# EAGLE design simple-loop3 (EAGLE 6.6.0)
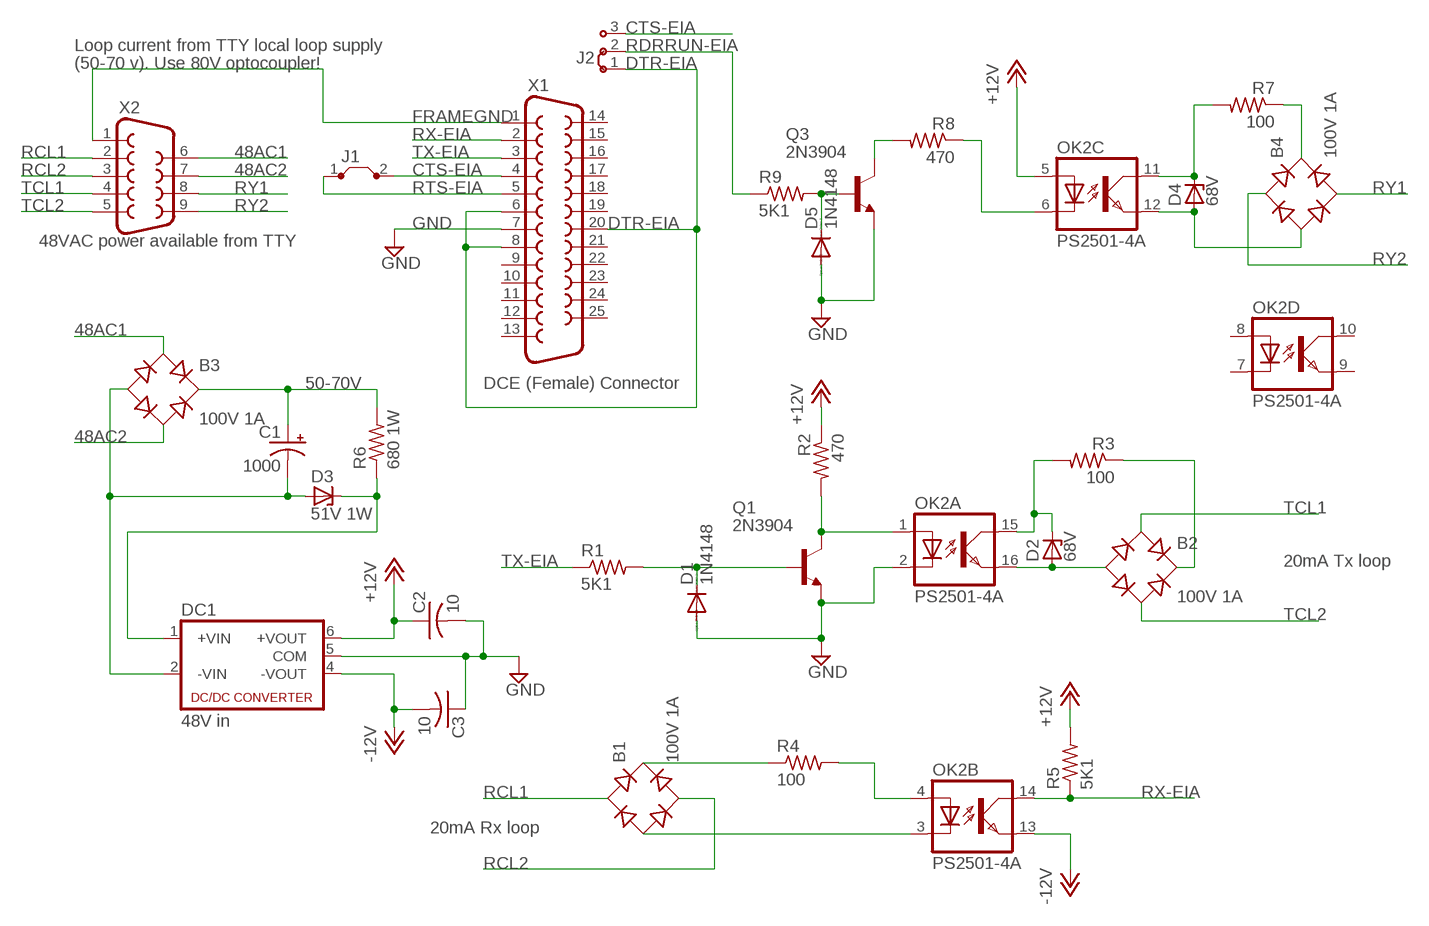
[diagram p0: schematic, sheet 1]

## Parts
B1  100V 1A  RB1A  [RB1A]
B2  100V 1A  RB1A  [RB1A]
B3  100V 1A  RB1A  [RB1A]
B4  100V 1A  RB1A  [RB1A]
C1  1000  CPOL-USE7.5-18  [E7,5-18]
C2  10  C-US025-025X050  [C025-025X050]
C3  10  C-US025-025X050  [C025-025X050]
D1  1N4148  1N4148DO35-10  [DO35-10]
D2  68V  ZENER-DIODEDO41Z10  [DO41Z10]
D3  51V 1W  ZENER-DIODEDO41Z10  [DO41Z10]
D4  68V  ZENER-DIODEDO41Z10  [DO41Z10]
D5  1N4148  1N4148DO35-10  [DO35-10]
DC1  48V in  NMA  [NMA]
J1  J5MM  [05]
J2  J2X5MM  [05C]
OK2  PS2501-4A  ILQ1  [DIL16]
Q1  2N3904  [TO92]
Q3  2N3904  [TO92]
R1  5K1  R-US_0207/10  [0207/10]
R2  470  R-US_0207/10  [0207/10]
R3  100  R-US_0207/10  [0207/10]
R4  100  R-US_0207/10  [0207/10]
R5  5K1  R-US_0207/10  [0207/10]
R6  680 1W  R-US_0617/17  [0617/17]
R7  100  R-US_0207/10  [0207/10]
R8  470  R-US_0207/10  [0207/10]
R9  5K1  R-US_0207/10  [0207/10]
X1  F25H  [F25H]
X2  F09H  [F09H]

## Nets
48AC1: B3.AC1 X2.6
48AC2: B3.AC2 X2.7
50-70V: B3.+ C1.+ R6.2
+12V: C2.1 DC1.6(+VOUT) OK2.5(C:A) R2.1 R5.2
-12V: C3.2 DC1.4(-VOUT) OK2.13(B:EMIT)
CTS-EIA: J1.2 J2.3 X1.4
DTR-EIA: J2.1 X1.6 X1.8 X1.20
FRAMEGND: X1.1 X2.1
GND: C2.2 C3.1 D1.A D5.A DC1.5(COM) OK2.2(A:C) Q1.3(E) Q3.3(E) X1.7
N$1: OK2.4(B:A) R4.2
N$2: B1.+ R4.1
N$3: B1.- OK2.3(B:C)
N$4: B2.- D2.A OK2.16(A:EMIT)
N$5: B2.+ R3.1
N$6: D2.C OK2.15(A:COL) R3.2
N$7: D1.C Q1.2(B) R1.2
N$8: D3.C DC1.1(+VIN) R6.1
N$9: OK2.1(A:A) Q1.1(C) R2.2
N$10: B3.- C1.- D3.A DC1.2(-VIN)
N$11: D4.C OK2.11(C:COL) R7.2
N$12: B4.- D4.A OK2.12(C:EMIT)
N$13: B4.+ R7.1
N$15: OK2.6(C:C) R8.1
N$16: D5.C Q3.2(B) R9.2
N$17: Q3.1(C) R8.2
RCL1: B1.AC1 X2.2
RCL2: B1.AC2 X2.3
RDRRUN-EIA: J2.2 R9.1
RTS-EIA: J1.1 X1.5
RX-EIA: OK2.14(B:COL) R5.1 X1.2
RY1: B4.AC2 X2.8
RY2: B4.AC1 X2.9
TCL1: B2.AC1 X2.4
TCL2: B2.AC2 X2.5
TX-EIA: R1.1 X1.3
Unconnected: OK2.7(D:C) OK2.8(D:A) OK2.9(D:EMIT) OK2.10(D:COL) X1.9 X1.10 X1.11 X1.12 X1.13 X1.14 X1.15 X1.16 X1.17 X1.18 X1.19 X1.21 X1.22 X1.23 X1.24 X1.25

## Notes on the sheet
- Loop current from TTY local loop supply
- (50-70 v). Use 80V optocoupler!
- 48VAC power available from TTY
- DCE (Female) Connector
- 20mA Tx loop
- 20mA Rx loop

## Library data of the parts
B1-B4 = rectifier:RB1A: RECTIFIER 1 A
C1 = rcl:CPOL-US: POLARIZED CAPACITOR, American symbol
C2 C3 = rcl:C-US: CAPACITOR, American symbol
D1 D5 = diode:1N4148: DIODE high speed (Philips)
D2-D4 = diode:ZENER-DIODE: Z-Diode
DC1 = dc-dc-converter:NMA: DC-DC CONVERTER; MF: C & D TECHNOLOGIES, INC; MPN: NMA0515SC; OC_FARNELL: 1021434; OC_NEWARK: 61K3064
J1 = jumper:J: Bridge
J2 = jumper:J2: Jumper switch 2 x 2.5 mm
OK2 = optocoupler:ILQ1: SIEMENS OPTO COUPLER; MF: VISHAY/TELEFUNKEN; MPN: ILQ1; OC_FARNELL: 1469501; OC_NEWARK: 88K1954
Q1 Q3 = transistor-npn:2N3904: NPN Transistor
R1-R9 = rcl:R-US_: RESISTOR, American symbol
X1 = con-subd:F25: SUB-D; OC_FARNELL: unknown; OC_NEWARK: unknown
X2 = con-subd:F09: SUB-D; OC_FARNELL: unknown; OC_NEWARK: unknown

## Board
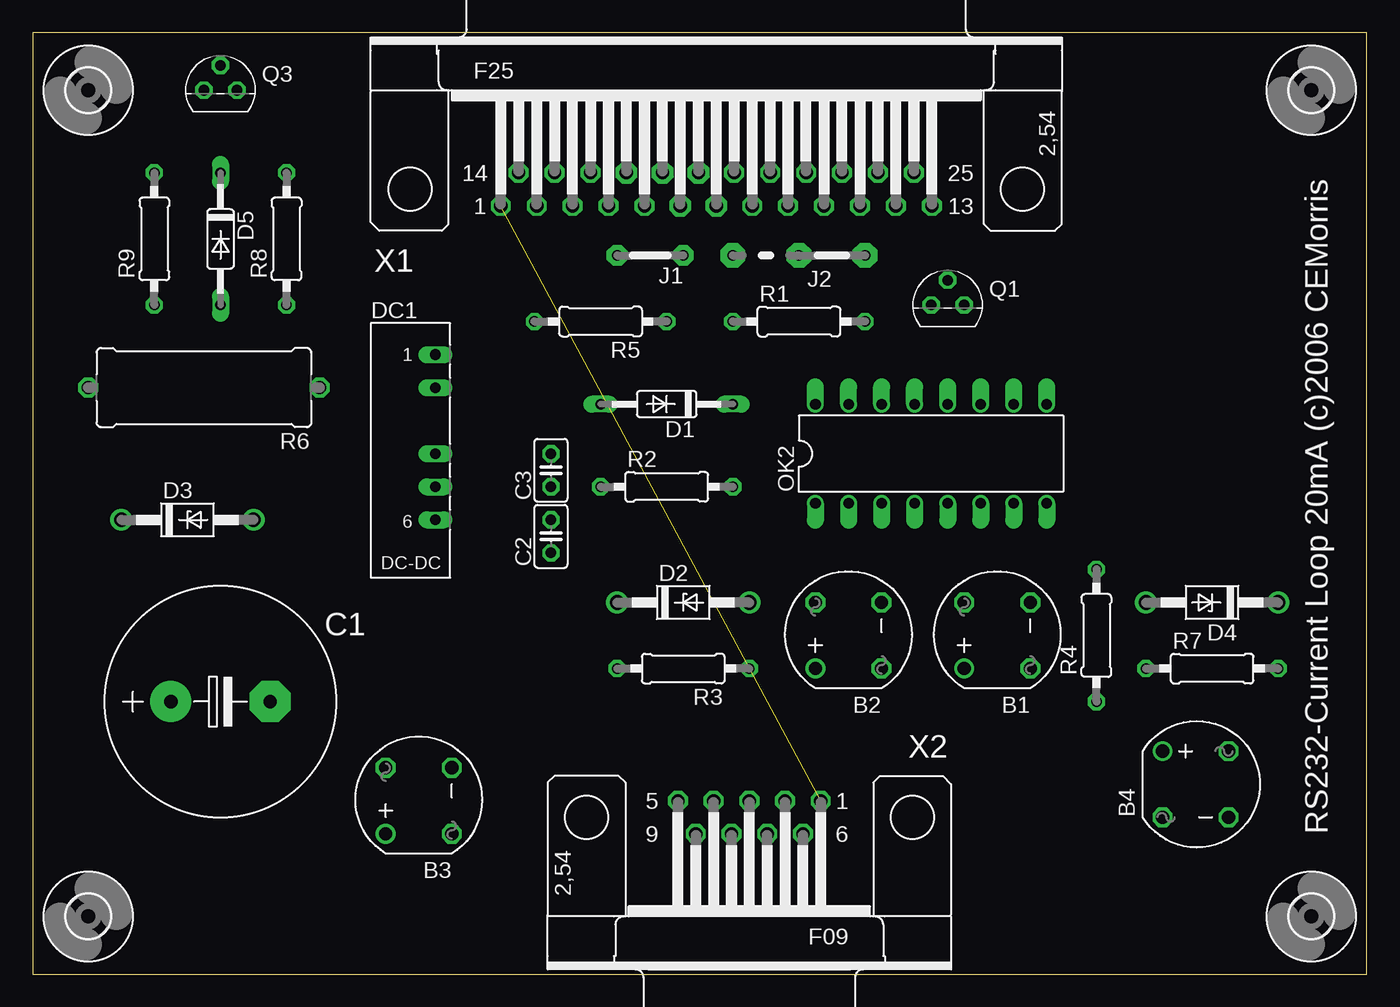
[diagram p1: board, top side]
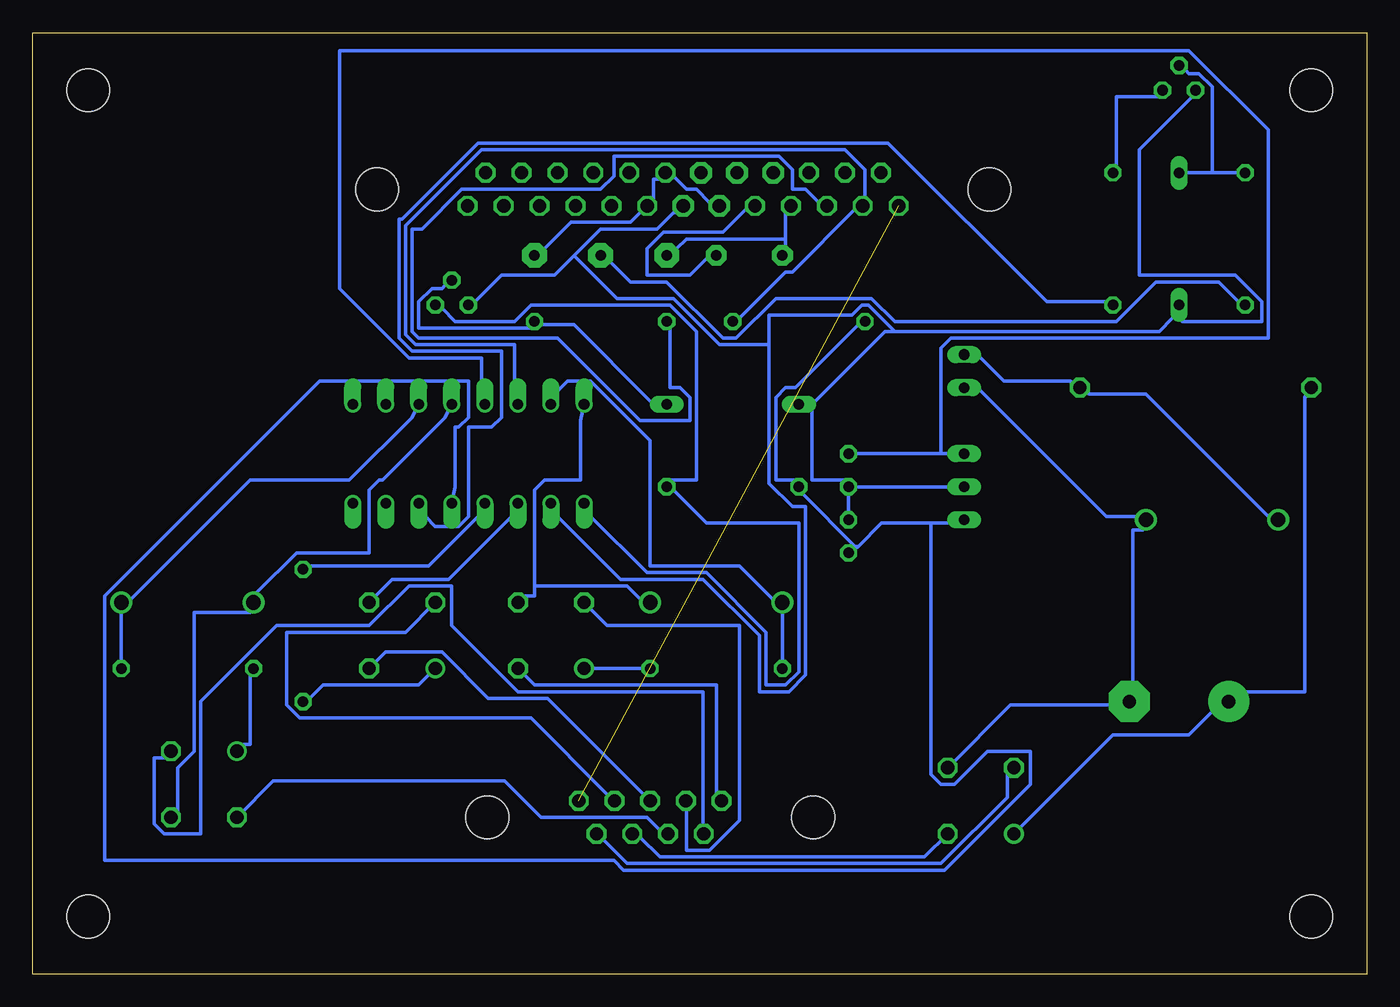
[diagram p2: board, bottom side, seen from below]

Size 102.54 x 72.37 mm. Coordinates in mm from the lower left corner, seen from the top.
Outline: 102.54,0 102.54,72.37 0,72.37 0,0 102.54,0
Copper layers (1*16): Top 0.035mm / dielectric 1.5mm / Bottom 0.035mm
Design rules "10mils *": minimum track width 10mil, minimum drill 24mil, track to track 10mil, track to pad 10mil, pad to pad 10mil, via to via 10mil, smd to smd 10mil, copper to edge 40mil, drill to drill 10mil, minimum pad ring 10mil, minimum via ring 8mil, stop-mask expansion 0mil, vias tented up to drill 0mil, thermal gap 10mil

### Footprints (pad centres in the part's own frame; a part is rotated, then mirrored left to right if it is on the bottom)
RB1A = drill 1.016: + -2.54,2.54 | drill 1.016 octagon: - 2.54,-2.54; AC1 2.54,2.54; AC2 -2.54,-2.54
E7,5-18 = drill 1.016 pad 3.15: + -3.81,0 | drill 1.016 pad 3.15 octagon: - 3.81,0
C025-025X050 = drill 0.813 octagon: 1 -1.27,0; 2 1.27,0
DO35-10 = drill 0.813 long: A 5.08,0; C -5.08,0
DO41Z10 = drill 1.118: A 5.08,0; C -5.08,0
NMA = drill 0.813 long: 1 0,6.35; 2 0,3.81; 4 0,-1.27; 5 0,-3.81; 6 0,-6.35
05 = drill 0.813 pad 1.6 octagon: 1 -2.54,0; 2 2.54,0
05C = drill 0.813 pad 1.905 octagon: 1 -2.54,0; 2 2.54,0; 3 7.62,0
DIL16 = drill 0.813 offset: 1 -8.89,-3.81; 2 -6.35,-3.81; 3 -3.81,-3.81; 4 -1.27,-3.81; 5 1.27,-3.81; 6 3.81,-3.81; 7 6.35,-3.81; 8 8.89,-3.81; 9 8.89,3.81; 10 6.35,3.81; 11 3.81,3.81; 12 1.27,3.81; 13 -1.27,3.81; 14 -3.81,3.81; 15 -6.35,3.81; 16 -8.89,3.81
TO92 = drill 0.813 octagon: 1 1.27,0; 2 0,1.905; 3 -1.27,0
0207/10 = drill 0.813 octagon: 1 -5.08,0; 2 5.08,0
0617/17 = drill 1.016 octagon: 1 -8.89,0; 2 8.89,0
3,3 = hole 3.3: 0,0
F25H = drill 1.016 octagon: 1 -16.561,-1.27; 2 -13.792,-1.27; 3 -11.049,-1.27; 4 -8.28,-1.27; 5 -5.512,-1.27; 8 2.769,-1.27; 9 5.512,-1.27; 10 8.28,-1.27; 11 11.049,-1.27; 12 13.792,-1.27; 13 16.561,-1.27; 14 -15.189,1.27; 15 -12.421,1.27; 16 -9.652,1.27; 20 1.372,1.27; 21 4.14,1.27; 22 6.909,1.27; 23 9.652,1.27; 24 12.421,1.27; 25 15.189,1.27 | drill 1.016 pad 1.67 octagon: 6 -2.769,-1.27; 7 0,-1.27; 17 -6.909,1.27; 18 -4.14,1.27; 19 -1.372,1.27 | hole 3.302: -23.52,0; 23.52,0
F09H = drill 1.016 octagon: 1 -5.486,-1.27; 2 -2.743,-1.27; 3 0,-1.27; 4 2.743,-1.27; 5 5.486,-1.27; 6 -4.115,1.27; 7 -1.372,1.27; 8 1.372,1.27; 9 4.115,1.27 | hole 3.302: -12.522,0; 12.522,0

### Placement (x,y rotation side)
B1  74.13,26.03 90 top
B2  62.7,26.03 90 top
B3  29.68,13.33 90 top
B4  89.37,14.6 0 top
C1  14.44,20.95 0 top
C2  39.84,33.65 90 top
C3  39.84,38.73 90 top
D1  48.73,43.81 180 top
D2  50,28.57 0 top
D3  11.9,34.92 0 top
D4  90.64,28.57 180 top
D5  14.44,56.51 270 top
DC1  30.95,41.27 0 top
J1  47.46,55.24 180 top
J2  61.43,55.24 180 top
OK2  69.05,40 0 top
Q1  70.32,51.43 0 top
Q3  14.44,67.94 0 top
R1  58.89,50.16 0 top
R2  48.73,37.46 0 top
R3  50,23.49 180 top
R4  81.75,26.03 90 top
R5  43.65,50.16 180 top
R6  13.17,45.08 180 top
R7  90.64,23.49 0 top
R8  19.52,56.51 90 top
R9  9.36,56.51 90 top
U$1  [3,3]  4.28,67.94 0 top
U$2  [3,3]  4.28,4.44 0 top
U$3  [3,3]  98.26,67.94 0 top
U$4  [3,3]  98.26,4.44 0 top
X1  52.54,60.32 0 top
X2  55.08,12.06 180 top

### Tracks (layer width: path | path; a pad name or v marks a point on that pad's centre or on a via)
48AC1
  Bottom 0.254: X2.6 58.64,10.28 56.86,8.5 32.73,8.5 27.65,13.58 27.65,15.36 B3.AC1
48AC2
  Bottom 0.254: B3.AC2 34,9.01 54.32,9.01 55.84,10.54 X2.7
50-70V
  Bottom 0.254: B3.+ 19.52,18.41 13.68,18.41 11.39,20.7 C1.+ 10.38,21.71 4.79,21.71 4.79,44.32 R6.2
+12V
  Bottom 0.254: R5.2 39.08,49.91 43.9,45.08 44.67,45.08 45.43,44.32 45.43,37.97 43.9,37.97 R2.1 43.4,36.95 39.33,32.89 39.08,32.89 | 39.08,32.89 37.3,34.67 33.49,34.67 | 39.08,32.89 39.33,32.63 C2.1 | 33.49,34.67 32.22,34.67 DC1.6 | 33.49,34.67 33.49,15.36 32.73,14.6 31.71,14.6 29.17,17.14 25.87,17.14 25.87,14.6 32.47,8 57.11,8 57.87,8.76 96.99,8.76 96.99,29.08 80.48,45.59 69.05,45.59 69.05,42.79 69.81,42.03 70.07,42.03 70.07,37.46 OK2.5
-12V
  Bottom 0.254: 32.73,40 C3.2 | 32.73,40 DC1.4 | 32.73,40 32.73,48.13 31.97,48.89 7.58,48.89 7.58,64.89 13.68,70.99 78.96,70.99 78.96,52.7 73.62,47.37 68.03,47.37 68.03,45.08 OK2.13
CTS-EIA
  Bottom 0.254: 44.67,56.51 44.67,56 J1.2 | 44.67,56.51 44.67,58.54 X1.4 | 44.67,56.51 52.29,56.51 53.05,55.75 J2.3
DTR-EIA
  Bottom 0.254: X1.6 50.51,59.3 51.52,60.32 52.29,60.32 53.3,61.34 X1.20 54.32,61.08 54.83,61.08 54.83,59.56 X1.8 55.84,58.54 56.6,57.78 61.18,57.78 63.21,55.75 J2.1
FRAMEGND  (1 unrouted)
GND
  Bottom 0.254: 60.92,55.24 58.89,57.27 54.57,57.27 53.3,58.54 53.05,58.54 X1.7 | 60.92,55.24 62.45,53.72 66.51,53.72 68.54,51.68 Q1.3 | C3.1 C2.2 | C3.1 DC1.5 | C3.1 40.09,37.97 42.63,37.97 42.63,43.3 D1.A 42.38,44.06 37.05,49.4 36.28,49.4 | 36.28,49.4 15.96,49.4 14.95,50.41 D5.A 14.19,50.16 8.09,50.16 8.09,51.68 10.12,53.72 17.49,53.72 17.49,63.37 13.42,67.43 Q3.3 | 45.94,48.38 45.94,50.67 39.59,50.67 38.82,51.43 38.32,51.43 36.28,49.4 | 45.94,48.38 45.94,37.71 44.16,35.94 43.14,35.94 43.14,22.98 44.41,21.71 46.7,21.71 46.7,26.03 51.02,30.35 57.37,30.35 62.19,35.17 OK2.2 | 60.92,55.24 57.62,51.94 53.3,51.94 49.75,48.38 45.94,48.38
N$1
  Bottom 0.254: OK2.4 68.29,35.17 72.1,31.36 81.24,31.36 R4.2
N$2
  Bottom 0.254: R4.1 81.24,21.2 80.23,22.22 72.86,22.22 B1.+
N$3
  Bottom 0.254: OK2.3 65.75,35.17 70.57,30.35 74.89,30.35 B1.-
N$4
  Bottom 0.254: 63.97,29.84 63.97,29.08 64.73,29.08 B2.- | 63.97,29.84 63.97,37.21 63.21,37.97 60.41,37.97 60.41,42.54 OK2.16 | 63.97,29.84 56.86,29.84 55.84,28.82 D2.A
N$5
  Bottom 0.254: R3.1 B2.+
N$6
  Bottom 0.254: R3.2 D2.C 45.68,28.82 48.22,31.36 55.08,31.36 55.08,41.02 59.65,45.59 61.43,45.59 62.19,44.83 OK2.15
N$7
  Bottom 0.254: D1.C 55.08,44.06 60.92,49.91 63.46,49.91 R1.2 64.22,49.65 72.86,49.65 72.86,51.68 71.84,52.7 71.08,52.7 70.83,52.95 Q1.2
N$8
  Bottom 0.254: DC1.1 29.68,47.37 27.9,45.59 22.82,45.59 R6.1 21.3,44.57 16.98,44.57 7.58,35.17 D3.C
N$9
  Bottom 0.254: OK2.1 59.65,35.17 55.33,30.86 50.76,30.86 46.19,26.28 46.19,22.22 44.67,22.22 43.65,23.24 43.65,34.67 50.76,34.67 53.3,37.21 R2.2 53.56,37.97 51.52,37.97 51.52,49.4 53.56,51.43 64.22,51.43 65.49,50.16 70.07,50.16 71.08,51.18 Q1.1
N$10
  Bottom 0.254: B3.- 27.39,20.7 19.01,20.7 C1.- 18,21.71 18,34.16 17.23,34.16 D3.A 17.74,35.17 20.03,35.17 29.68,44.83 DC1.2
N$11
  Bottom 0.254: OK2.11 73.37,42.79 78.19,37.97 85.81,37.97 94.96,28.82 D4.C R7.2
N$12
  Bottom 0.254: OK2.12 70.83,42.79 75.65,37.97 75.91,37.97 76.67,37.21 76.67,32.38 82.26,32.38 85.31,29.33 D4.A 85.81,27.81 90.13,27.81 90.13,17.14 91.4,15.87 91.4,12.57 B4.-
N$13
  Bottom 0.254: R7.1 85.81,22.98 85.81,17.65 86.32,17.65 B4.+
N$15
  Bottom 0.254: OK2.6 72.35,35.17 71.59,34.41 69.81,34.41 69.05,35.17 69.05,42.03 67.27,42.03 66.51,42.79 66.51,47.87 73.37,47.87 74.38,48.89 74.38,58.03 74.13,58.03 68.29,63.88 36.79,63.88 24.6,51.68 20.03,51.68 R8.1
N$16
  Bottom 0.254: R9.2 11.9,61.59 | 11.9,61.59 D5.C | 11.9,61.59 11.9,68.19 12.92,69.21 13.68,69.21 13.93,69.46 Q3.2
N$17
  Bottom 0.254: R8.2 19.27,62.1 19.27,67.43 15.96,67.43 Q3.1
RCL1
  Bottom 0.254: X2.2 58.38,13.84 64.22,19.68 82,19.68 83.02,20.7 83.02,26.28 73.88,26.28 B1.AC1
RCL2
  Bottom 0.254: X2.3 62.95,21.2 67.53,21.2 71.08,24.76 75.4,24.76 B1.AC2
RDRRUN-EIA
  Bottom 0.254: R9.1 9.87,51.68 11.39,53.21 16.22,53.21 19.27,50.16 36.28,50.16 38.06,51.94 45.43,51.94 48.48,48.89 49.49,48.89 53.81,53.21 56.6,53.21 58.13,54.73 J2.2
RTS-EIA
  Bottom 0.254: X1.5 47.71,58.8 49.49,57.02 54.06,57.02 55.33,55.75 55.33,53.72 52.03,53.72 50.76,54.99 J1.1
RX-EIA
  Bottom 0.254: OK2.14 65.49,45.08 65.49,48.38 73.11,48.38 73.88,49.14 73.88,57.53 68.03,63.37 40.09,63.37 38.57,61.84 38.57,59.56 X1.2 39.33,58.8 44.16,53.97 44.67,53.97 48.22,50.41 R5.1
RY1
  Bottom 0.254: X2.8 54.32,11.04 55.33,12.06 63.46,12.06 66.26,14.85 84.04,14.85 B4.AC2
RY2
  Bottom 0.254: X2.9 51.02,11.3 51.02,21.71 65.24,21.71 70.32,26.79 70.32,29.84 73.62,29.84 76.67,26.79 83.78,26.79 89.62,20.95 89.62,10.79 92.42,10.79 93.18,11.55 93.18,16.63 92.42,16.63 B4.AC1
TCL1
  Bottom 0.254: X2.4 52.29,12.82 52.29,9.52 50.51,9.52 48.22,11.81 48.22,26.79 58.38,26.79 B2.AC1
TCL2
  Bottom 0.254: X2.5 50,13.84 50,22.22 63.97,22.22 B2.AC2
TX-EIA
  Bottom 0.254: R1.1 53.56,49.65 53.56,45.08 52.79,45.08 52.03,44.32 52.03,42.54 55.84,42.54 62.19,48.89 72.86,48.89 73.37,49.4 73.37,57.27 72.61,57.27 69.56,60.32 58.89,60.32 57.87,61.34 57.87,62.86 45.17,62.86 44.16,61.84 44.16,60.32 43.14,60.32 42.13,59.3 X1.3

### Text on the board
tNames: RS232-Current Loop 20mA (c)2006 CEMorris